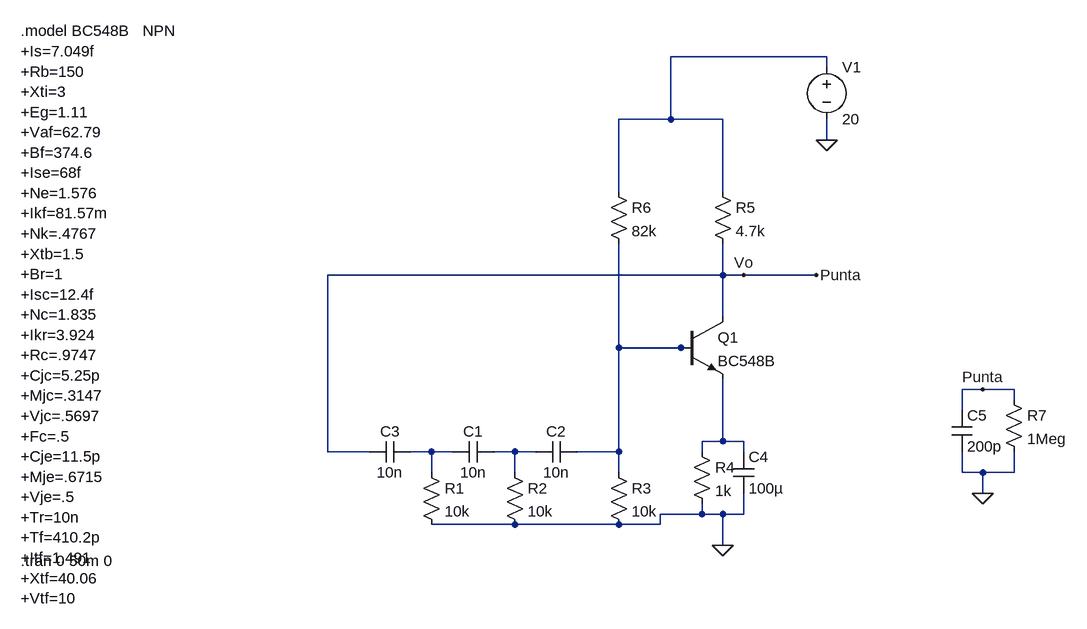
[diagram p0: schematic D_Oscilador.asc]
D_Oscilador.asc, the LTspice schematic file:
Version 4
SHEET 1 1052 680
WIRE 672 -480 432 -480
WIRE 672 -464 672 -480
WIRE 432 -384 432 -480
WIRE 432 -384 352 -384
WIRE 512 -384 432 -384
WIRE 672 -352 672 -384
WIRE 352 -272 352 -384
WIRE 512 -272 512 -384
WIRE 512 -144 512 -192
WIRE 512 -144 -96 -144
WIRE 544 -144 512 -144
WIRE 656 -144 544 -144
WIRE 512 -80 512 -144
WIRE 352 -32 352 -192
WIRE 448 -32 352 -32
WIRE 464 -32 448 -32
WIRE 912 32 880 32
WIRE 960 32 912 32
WIRE 960 48 960 32
WIRE 880 64 880 32
WIRE 512 112 512 16
WIRE 512 112 480 112
WIRE 544 112 512 112
WIRE -96 128 -96 -144
WIRE -32 128 -96 128
WIRE 64 128 32 128
WIRE 96 128 64 128
WIRE 192 128 160 128
WIRE 224 128 192 128
WIRE 352 128 352 -32
WIRE 352 128 288 128
WIRE 480 128 480 112
WIRE 544 128 544 112
WIRE 64 160 64 128
WIRE 192 160 192 128
WIRE 352 160 352 128
WIRE 880 160 880 128
WIRE 912 160 880 160
WIRE 960 160 960 128
WIRE 960 160 912 160
WIRE 912 192 912 160
WIRE 480 224 480 208
WIRE 480 224 416 224
WIRE 512 224 480 224
WIRE 544 224 544 192
WIRE 544 224 512 224
WIRE 192 240 64 240
WIRE 352 240 192 240
WIRE 416 240 416 224
WIRE 416 240 352 240
WIRE 512 272 512 224
FLAG 512 272 0
FLAG 672 -352 0
FLAG 912 192 0
FLAG 912 32 Punta
FLAG 656 -144 Punta
FLAG 544 -144 Vo
SYMBOL res 48 144 R0
SYMATTR InstName R1
SYMATTR Value 10k
SYMBOL cap 160 112 R90
WINDOW 0 0 32 VBottom 2
WINDOW 3 32 32 VTop 2
SYMATTR InstName C1
SYMATTR Value 10n
SYMBOL res 176 144 R0
SYMATTR InstName R2
SYMATTR Value 10k
SYMBOL cap 288 112 R90
WINDOW 0 0 32 VBottom 2
WINDOW 3 32 32 VTop 2
SYMATTR InstName C2
SYMATTR Value 10n
SYMBOL cap 32 112 R90
WINDOW 0 0 32 VBottom 2
WINDOW 3 32 32 VTop 2
SYMATTR InstName C3
SYMATTR Value 10n
SYMBOL res 336 144 R0
SYMATTR InstName R3
SYMATTR Value 10k
SYMBOL npn 448 -80 R0
SYMATTR InstName Q1
SYMATTR Value BC548B
SYMBOL res 464 112 R0
SYMATTR InstName R4
SYMATTR Value 1k
SYMBOL cap 528 128 R0
SYMATTR InstName C4
SYMATTR Value 100µ
SYMBOL res 496 -288 R0
SYMATTR InstName R5
SYMATTR Value 4.7k
SYMBOL res 336 -288 R0
SYMATTR InstName R6
SYMATTR Value 82k
SYMBOL voltage 672 -480 R0
WINDOW 123 0 0 Left 2
WINDOW 39 0 0 Left 2
SYMATTR InstName V1
SYMATTR Value 20
SYMBOL cap 864 64 R0
SYMATTR InstName C5
SYMATTR Value 200p
SYMBOL res 944 32 R0
SYMATTR InstName R7
SYMATTR Value 1Meg
TEXT -568 296 Left 2 !.tran 0 50m 0
TEXT -568 -520 Left 2 !.model BC548B   NPN\n+Is=7.049f\n+Rb=150\n+Xti=3\n+Eg=1.11\n+Vaf=62.79\n+Bf=374.6\n+Ise=68f\n+Ne=1.576\n+Ikf=81.57m\n+Nk=.4767\n+Xtb=1.5\n+Br=1\n+Isc=12.4f\n+Nc=1.835\n+Ikr=3.924\n+Rc=.9747\n+Cjc=5.25p\n+Mjc=.3147\n+Vjc=.5697\n+Fc=.5\n+Cje=11.5p\n+Mje=.6715\n+Vje=.5\n+Tr=10n\n+Tf=410.2p\n+Itf=1.491\n+Xtf=40.06\n+Vtf=10

The netlist it stands for:
* D_Oscilador.asc
R1 N004 0 10k
C1 N005 N004 10n
R2 N005 0 10k
C2 N002 N005 10n
C3 N004 Vo 10n
R3 N002 0 10k
Q1 Vo N002 N003 0 BC548B
R4 N003 0 1k
C4 N003 0 100µ
R5 N001 Vo 4.7k
R6 N001 N002 82k
V1 N001 0 20
C5 Vo 0 200p
R7 Vo 0 1Meg
.model NPN NPN
.model PNP PNP
.lib standard.bjt
.tran 0 50m 0
.model BC548B   NPN
+Is=7.049f
+Rb=150
+Xti=3
+Eg=1.11
+Vaf=62.79
+Bf=374.6
+Ise=68f
+Ne=1.576
+Ikf=81.57m
+Nk=.4767
+Xtb=1.5
+Br=1
+Isc=12.4f
+Nc=1.835
+Ikr=3.924
+Rc=.9747
+Cjc=5.25p
+Mjc=.3147
+Vjc=.5697
+Fc=.5
+Cje=11.5p
+Mje=.6715
+Vje=.5
+Tr=10n
+Tf=410.2p
+Itf=1.491
+Xtf=40.06
+Vtf=10
.backanno
.end